# Altium schematic sheet mini_backplane.SchDoc
size A3
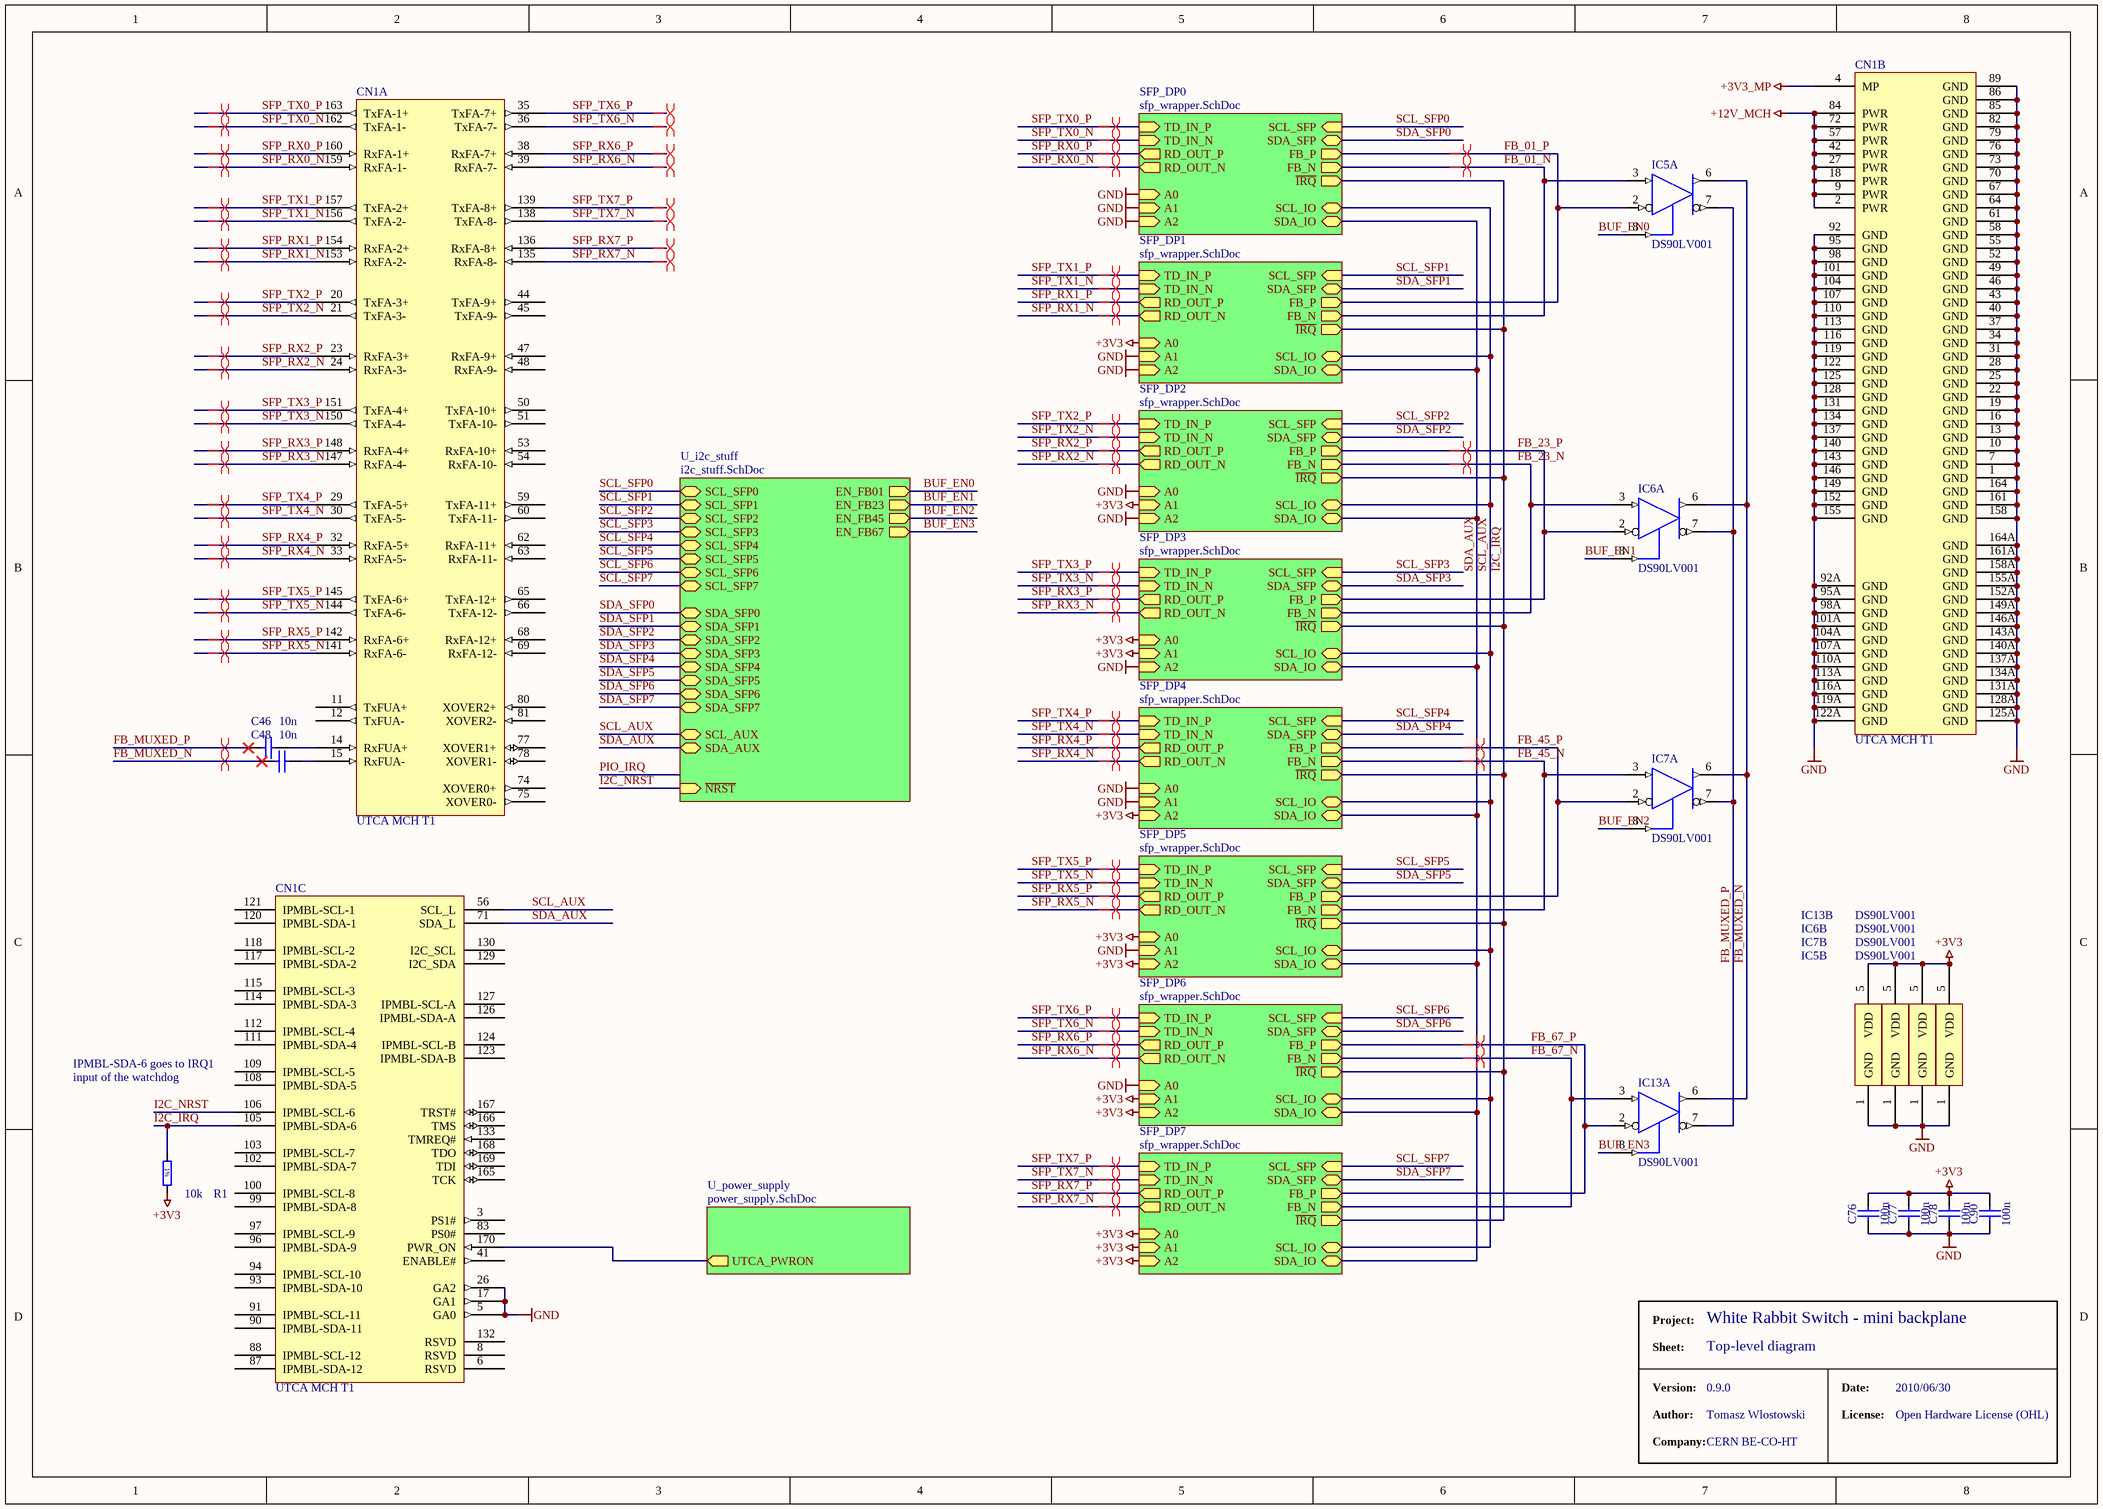
[diagram p0: mini_backplane.SchDoc]

## Parts
C46  10n  [CAPC1608X87N]
C48  10n  [CAPC1608X87N]
C76  100n  [CAPC1608X87N]
C77  100n  [CAPC1608X87N]
C78  100n  [CAPC1608X87N]
C90  100n  [CAPC1608X87N]
CN1  UTCA MCH T1  [CON_AMC_MOLEX_75800_00001_REVERSE]  (parts A,B,C of 3)
IC5  DS90LV001  [SOIC127P600-8AL]  (parts A,B of 2)
IC6  DS90LV001  [SOIC127P600-8AL]  (parts A,B of 2)
IC7  DS90LV001  [SOIC127P600-8AL]  (parts A,B of 2)
IC13  DS90LV001  [SOIC127P600-8AL]  (parts A,B of 2)
R1  10k  [RESC1608X55N]

## Sub-sheets
SFP_DP0 = sfp_wrapper.SchDoc: RD_OUT_N (out), RD_OUT_P (out), TD_IN_N (in), TD_IN_P (in), SDA_SFP (bidir), SCL_SFP (in), FB_P (out), FB_N (out), ~{IRQ} (out), A0 (in), A1 (in), A2 (in), SCL_IO (bidir), SDA_IO (bidir)
SFP_DP1 = sfp_wrapper.SchDoc: RD_OUT_N (out), RD_OUT_P (out), TD_IN_N (in), TD_IN_P (in), SDA_SFP (bidir), SCL_SFP (in), FB_P (out), FB_N (out), ~{IRQ} (out), A0 (in), A1 (in), A2 (in), SCL_IO (bidir), SDA_IO (bidir)
SFP_DP2 = sfp_wrapper.SchDoc: RD_OUT_N (out), RD_OUT_P (out), TD_IN_N (in), TD_IN_P (in), SDA_SFP (bidir), SCL_SFP (in), FB_P (out), FB_N (out), ~{IRQ} (out), A0 (in), A1 (in), A2 (in), SCL_IO (bidir), SDA_IO (bidir)
SFP_DP3 = sfp_wrapper.SchDoc: RD_OUT_N (out), RD_OUT_P (out), TD_IN_N (in), TD_IN_P (in), SDA_SFP (bidir), SCL_SFP (in), FB_P (out), FB_N (out), ~{IRQ} (out), A0 (in), A1 (in), A2 (in), SCL_IO (bidir), SDA_IO (bidir)
SFP_DP4 = sfp_wrapper.SchDoc: RD_OUT_N (out), RD_OUT_P (out), TD_IN_N (in), TD_IN_P (in), SDA_SFP (bidir), SCL_SFP (in), FB_P (out), FB_N (out), ~{IRQ} (out), A0 (in), A1 (in), A2 (in), SCL_IO (bidir), SDA_IO (bidir)
SFP_DP5 = sfp_wrapper.SchDoc: RD_OUT_N (out), RD_OUT_P (out), TD_IN_N (in), TD_IN_P (in), SDA_SFP (bidir), SCL_SFP (in), FB_P (out), FB_N (out), ~{IRQ} (out), A0 (in), A1 (in), A2 (in), SCL_IO (bidir), SDA_IO (bidir)
SFP_DP6 = sfp_wrapper.SchDoc: RD_OUT_N (out), RD_OUT_P (out), TD_IN_N (in), TD_IN_P (in), SDA_SFP (bidir), SCL_SFP (in), FB_P (out), FB_N (out), ~{IRQ} (out), A0 (in), A1 (in), A2 (in), SCL_IO (bidir), SDA_IO (bidir)
SFP_DP7 = sfp_wrapper.SchDoc: RD_OUT_N (out), RD_OUT_P (out), TD_IN_N (in), TD_IN_P (in), SDA_SFP (bidir), SCL_SFP (in), FB_P (out), FB_N (out), ~{IRQ} (out), A0 (in), A1 (in), A2 (in), SCL_IO (bidir), SDA_IO (bidir)
U_i2c_stuff = i2c_stuff.SchDoc: SCL_SFP0 (bidir), SCL_SFP1 (bidir), SCL_SFP2 (bidir), SCL_SFP3 (bidir), SCL_SFP4 (bidir), SCL_SFP5 (bidir), SCL_SFP6 (bidir), SCL_SFP7 (bidir), SDA_SFP0 (bidir), SDA_SFP1 (bidir), SDA_SFP2 (bidir), SDA_SFP3 (bidir), SDA_SFP4 (bidir), SDA_SFP5 (bidir), SDA_SFP6 (bidir), SDA_SFP7 (bidir), SCL_AUX (bidir), SDA_AUX (bidir), ~{NRST} (in), EN_FB01 (out), EN_FB23 (out), EN_FB45 (out), EN_FB67 (out)
U_power_supply = power_supply.SchDoc: UTCA_PWRON (out)

## Nets
+3V3: C76.2 C77.2 C78.2 C90.2 IC5.5(VDD) IC6.5(VDD) IC7.5(VDD) IC13.5(VDD) R1.2 ; sheet SFP_DP1/A0, sheet SFP_DP2/A1, sheet SFP_DP3/A0, sheet SFP_DP3/A1, sheet SFP_DP4/A2, sheet SFP_DP5/A0, sheet SFP_DP5/A2, sheet SFP_DP6/A1, sheet SFP_DP6/A2, sheet SFP_DP7/A0, sheet SFP_DP7/A1, sheet SFP_DP7/A2
+3V3_MP: CN1.4(MP)
+12V_MCH: CN1.2(PWR) CN1.9(PWR) CN1.18(PWR) CN1.27(PWR) CN1.42(PWR) CN1.57(PWR) CN1.72(PWR) CN1.84(PWR)
GND: C76.1 C77.1 C78.1 C90.1 CN1.1(GND) CN1.5(GA0) CN1.7(GND) CN1.10(GND) CN1.13(GND) CN1.16(GND) CN1.17(GA1) CN1.19(GND) CN1.22(GND) CN1.25(GND) CN1.26(GA2) CN1.28(GND) CN1.31(GND) CN1.34(GND) CN1.37(GND) CN1.40(GND) CN1.43(GND) CN1.46(GND) CN1.49(GND) CN1.52(GND) CN1.55(GND) CN1.58(GND) CN1.61(GND) CN1.64(GND) CN1.67(GND) CN1.70(GND) CN1.73(GND) CN1.76(GND) CN1.79(GND) CN1.82(GND) CN1.85(GND) CN1.86(GND) CN1.89(GND) CN1.92(GND) CN1.92A(GND) CN1.95(GND) CN1.95A(GND) CN1.98(GND) CN1.98A(GND) CN1.101(GND) CN1.101A(GND) CN1.104(GND) CN1.104A(GND) CN1.107(GND) CN1.107A(GND) CN1.110(GND) CN1.110A(GND) CN1.113(GND) CN1.113A(GND) CN1.116(GND) CN1.116A(GND) CN1.119(GND) CN1.119A(GND) CN1.122(GND) CN1.122A(GND) CN1.125(GND) CN1.125A(GND) CN1.128(GND) CN1.128A(GND) CN1.131(GND) CN1.131A(GND) CN1.134(GND) CN1.134A(GND) CN1.137(GND) CN1.137A(GND) CN1.140(GND) CN1.140A(GND) CN1.143(GND) CN1.143A(GND) CN1.146(GND) CN1.146A(GND) CN1.149(GND) CN1.149A(GND) CN1.152(GND) CN1.152A(GND) CN1.155(GND) CN1.155A(GND) CN1.158(GND) CN1.158A(GND) CN1.161(GND) CN1.161A(GND) CN1.164(GND) CN1.164A(GND) IC5.1(GND) IC6.1(GND) IC7.1(GND) IC13.1(GND) ; sheet SFP_DP0/A0, sheet SFP_DP0/A1, sheet SFP_DP0/A2, sheet SFP_DP1/A1, sheet SFP_DP1/A2, sheet SFP_DP2/A0, sheet SFP_DP2/A2, sheet SFP_DP3/A2, sheet SFP_DP4/A0, sheet SFP_DP4/A1, sheet SFP_DP5/A1, sheet SFP_DP6/A0
BUF_EN0: IC5.8(EN) ; sheet U_i2c_stuff/EN_FB01
BUF_EN1: IC6.8(EN) ; sheet U_i2c_stuff/EN_FB23
BUF_EN2: IC7.8(EN) ; sheet U_i2c_stuff/EN_FB45
BUF_EN3: IC13.8(EN) ; sheet U_i2c_stuff/EN_FB67
FB_01_N: IC5.3(IN+) ; sheet SFP_DP0/FB_N, sheet SFP_DP1/FB_N
FB_01_P: IC5.2(IN-) ; sheet SFP_DP0/FB_P, sheet SFP_DP1/FB_P
FB_23_N: IC6.3(IN+) ; sheet SFP_DP2/FB_N, sheet SFP_DP3/FB_N
FB_23_P: IC6.2(IN-) ; sheet SFP_DP2/FB_P, sheet SFP_DP3/FB_P
FB_45_N: IC7.3(IN+) ; sheet SFP_DP4/FB_N, sheet SFP_DP5/FB_N
FB_45_P: IC7.2(IN-) ; sheet SFP_DP4/FB_P, sheet SFP_DP5/FB_P
FB_67_N: IC13.3(IN+) ; sheet SFP_DP6/FB_N, sheet SFP_DP7/FB_N
FB_67_P: IC13.2(IN-) ; sheet SFP_DP6/FB_P, sheet SFP_DP7/FB_P
FB_MUXED_N: C48.1 IC5.6(OUT+) IC6.6(OUT+) IC7.6(OUT+) IC13.6(OUT+)
FB_MUXED_P: C46.1 IC5.7(OUT-) IC6.7(OUT-) IC7.7(OUT-) IC13.7(OUT-)
I2C_IRQ: CN1.105(IPMBL-SDA-6) R1.1 ; sheet SFP_DP0/~{IRQ}, sheet SFP_DP1/~{IRQ}, sheet SFP_DP2/~{IRQ}, sheet SFP_DP3/~{IRQ}, sheet SFP_DP4/~{IRQ}, sheet SFP_DP5/~{IRQ}, sheet SFP_DP6/~{IRQ}, sheet SFP_DP7/~{IRQ}
I2C_NRST: CN1.106(IPMBL-SCL-6) ; sheet U_i2c_stuff/~{NRST}
SCL_AUX: CN1.56(SCL_L) ; sheet SFP_DP0/SCL_IO, sheet SFP_DP1/SCL_IO, sheet SFP_DP2/SCL_IO, sheet SFP_DP3/SCL_IO, sheet SFP_DP4/SCL_IO, sheet SFP_DP5/SCL_IO, sheet SFP_DP6/SCL_IO, sheet SFP_DP7/SCL_IO, sheet U_i2c_stuff/SCL_AUX
SCL_SFP0: sheet SFP_DP0/SCL_SFP, sheet U_i2c_stuff/SCL_SFP0
SCL_SFP1: sheet SFP_DP1/SCL_SFP, sheet U_i2c_stuff/SCL_SFP1
SCL_SFP2: sheet SFP_DP2/SCL_SFP, sheet U_i2c_stuff/SCL_SFP2
SCL_SFP3: sheet SFP_DP3/SCL_SFP, sheet U_i2c_stuff/SCL_SFP3
SCL_SFP4: sheet SFP_DP4/SCL_SFP, sheet U_i2c_stuff/SCL_SFP4
SCL_SFP5: sheet SFP_DP5/SCL_SFP, sheet U_i2c_stuff/SCL_SFP5
SCL_SFP6: sheet SFP_DP6/SCL_SFP, sheet U_i2c_stuff/SCL_SFP6
SCL_SFP7: sheet SFP_DP7/SCL_SFP, sheet U_i2c_stuff/SCL_SFP7
SDA_AUX: CN1.71(SDA_L) ; sheet SFP_DP0/SDA_IO, sheet SFP_DP1/SDA_IO, sheet SFP_DP2/SDA_IO, sheet SFP_DP3/SDA_IO, sheet SFP_DP4/SDA_IO, sheet SFP_DP5/SDA_IO, sheet SFP_DP6/SDA_IO, sheet SFP_DP7/SDA_IO, sheet U_i2c_stuff/SDA_AUX
SDA_SFP0: sheet SFP_DP0/SDA_SFP, sheet U_i2c_stuff/SDA_SFP0
SDA_SFP1: sheet SFP_DP1/SDA_SFP, sheet U_i2c_stuff/SDA_SFP1
SDA_SFP2: sheet SFP_DP2/SDA_SFP, sheet U_i2c_stuff/SDA_SFP2
SDA_SFP3: sheet SFP_DP3/SDA_SFP, sheet U_i2c_stuff/SDA_SFP3
SDA_SFP4: sheet SFP_DP4/SDA_SFP, sheet U_i2c_stuff/SDA_SFP4
SDA_SFP5: sheet SFP_DP5/SDA_SFP, sheet U_i2c_stuff/SDA_SFP5
SDA_SFP6: sheet SFP_DP6/SDA_SFP, sheet U_i2c_stuff/SDA_SFP6
SDA_SFP7: sheet SFP_DP7/SDA_SFP, sheet U_i2c_stuff/SDA_SFP7
SFP_RX0_N: CN1.159(RxFA-1-) ; sheet SFP_DP0/RD_OUT_N
SFP_RX0_P: CN1.160(RxFA-1+) ; sheet SFP_DP0/RD_OUT_P
SFP_RX1_N: CN1.153(RxFA-2-) ; sheet SFP_DP1/RD_OUT_N
SFP_RX1_P: CN1.154(RxFA-2+) ; sheet SFP_DP1/RD_OUT_P
SFP_RX2_N: CN1.24(RxFA-3-) ; sheet SFP_DP2/RD_OUT_N
SFP_RX2_P: CN1.23(RxFA-3+) ; sheet SFP_DP2/RD_OUT_P
SFP_RX3_N: CN1.147(RxFA-4-) ; sheet SFP_DP3/RD_OUT_N
SFP_RX3_P: CN1.148(RxFA-4+) ; sheet SFP_DP3/RD_OUT_P
SFP_RX4_N: CN1.33(RxFA-5-) ; sheet SFP_DP4/RD_OUT_N
SFP_RX4_P: CN1.32(RxFA-5+) ; sheet SFP_DP4/RD_OUT_P
SFP_RX5_N: CN1.141(RxFA-6-) ; sheet SFP_DP5/RD_OUT_N
SFP_RX5_P: CN1.142(RxFA-6+) ; sheet SFP_DP5/RD_OUT_P
SFP_RX6_N: CN1.39(RxFA-7-) ; sheet SFP_DP6/RD_OUT_N
SFP_RX6_P: CN1.38(RxFA-7+) ; sheet SFP_DP6/RD_OUT_P
SFP_RX7_N: CN1.135(RxFA-8-) ; sheet SFP_DP7/RD_OUT_N
SFP_RX7_P: CN1.136(RxFA-8+) ; sheet SFP_DP7/RD_OUT_P
SFP_TX0_N: CN1.162(TxFA-1-) ; sheet SFP_DP0/TD_IN_N
SFP_TX0_P: CN1.163(TxFA-1+) ; sheet SFP_DP0/TD_IN_P
SFP_TX1_N: CN1.156(TxFA-2-) ; sheet SFP_DP1/TD_IN_N
SFP_TX1_P: CN1.157(TxFA-2+) ; sheet SFP_DP1/TD_IN_P
SFP_TX2_N: CN1.21(TxFA-3-) ; sheet SFP_DP2/TD_IN_N
SFP_TX2_P: CN1.20(TxFA-3+) ; sheet SFP_DP2/TD_IN_P
SFP_TX3_N: CN1.150(TxFA-4-) ; sheet SFP_DP3/TD_IN_N
SFP_TX3_P: CN1.151(TxFA-4+) ; sheet SFP_DP3/TD_IN_P
SFP_TX4_N: CN1.30(TxFA-5-) ; sheet SFP_DP4/TD_IN_N
SFP_TX4_P: CN1.29(TxFA-5+) ; sheet SFP_DP4/TD_IN_P
SFP_TX5_N: CN1.144(TxFA-6-) ; sheet SFP_DP5/TD_IN_N
SFP_TX5_P: CN1.145(TxFA-6+) ; sheet SFP_DP5/TD_IN_P
SFP_TX6_N: CN1.36(TxFA-7-) ; sheet SFP_DP6/TD_IN_N
SFP_TX6_P: CN1.35(TxFA-7+) ; sheet SFP_DP6/TD_IN_P
SFP_TX7_N: CN1.138(TxFA-8-) ; sheet SFP_DP7/TD_IN_N
SFP_TX7_P: CN1.139(TxFA-8+) ; sheet SFP_DP7/TD_IN_P
NetC46_2: C46.2 CN1.14(RxFUA+)
NetC48_2: C48.2 CN1.15(RxFUA-)
NetCN1_170: CN1.170(PWR_ON) ; sheet U_power_supply/UTCA_PWRON

Not connected (* = marked no-connect by the designer): CN1 3(PS1#) 6(RSVD) 8(RSVD) 11(TxFUA+) 12(TxFUA-) 41(ENABLE#) 44(TxFA-9+) 45(TxFA-9-) 47(RxFA-9+) 48(RxFA-9-) 50(TxFA-10+) 51(TxFA-10-) 53(RxFA-10+) 54(RxFA-10-) 59(TxFA-11+) 60(TxFA-11-) 62(RxFA-11+) 63(RxFA-11-) 65(TxFA-12+) 66(TxFA-12-) 68(RxFA-12+) 69(RxFA-12-) 74(XOVER0+) 75(XOVER0-) 77(XOVER1+) 78(XOVER1-) 80(XOVER2+) 81(XOVER2-) 83(PS0#) 87(IPMBL-SDA-12) 88(IPMBL-SCL-12) 90(IPMBL-SDA-11) 91(IPMBL-SCL-11) 93(IPMBL-SDA-10) 94(IPMBL-SCL-10) 96(IPMBL-SDA-9) 97(IPMBL-SCL-9) 99(IPMBL-SDA-8) 100(IPMBL-SCL-8) 102(IPMBL-SDA-7) 103(IPMBL-SCL-7) 108(IPMBL-SDA-5) 109(IPMBL-SCL-5) 111(IPMBL-SDA-4) 112(IPMBL-SCL-4) 114(IPMBL-SDA-3) 115(IPMBL-SCL-3) 117(IPMBL-SDA-2) 118(IPMBL-SCL-2) 120(IPMBL-SDA-1) 121(IPMBL-SCL-1) 123(IPMBL-SDA-B) 124(IPMBL-SCL-B) 126(IPMBL-SDA-A) 127(IPMBL-SCL-A) 129(I2C_SDA) 130(I2C_SCL) 132(RSVD) 133(TMREQ#) 165(TCK) 166(TMS) 167(TRST#) 168(TDO) 169(TDI)

## Layout directives
differential pair: FB_01_N, FB_01_P, FB_23_N, FB_23_P, FB_45_N, FB_45_P, FB_67_N, FB_67_P, FB_MUXED_N, FB_MUXED_P, SFP_RX0_N, SFP_RX0_P, SFP_RX1_N, SFP_RX1_P, SFP_RX2_N, SFP_RX2_P, SFP_RX3_N, SFP_RX3_P, SFP_RX4_N, SFP_RX4_P, SFP_RX5_N, SFP_RX5_P, SFP_RX6_N, SFP_RX6_P, SFP_RX7_N, SFP_RX7_P, SFP_TX0_N, SFP_TX0_P, SFP_TX1_N, SFP_TX1_P, SFP_TX2_N, SFP_TX2_P, SFP_TX3_N, SFP_TX3_P, SFP_TX4_N, SFP_TX4_P, SFP_TX5_N, SFP_TX5_P, SFP_TX6_N, SFP_TX6_P, SFP_TX7_N, SFP_TX7_P

## Notes on the sheet
- IPMBL-SDA-6 goes to IRQ1
- input of the watchdog
- Project:
- White Rabbit Switch - mini backplane
- Sheet:
- Version:
- Top-level diagram
- 0.9.0
- Date:
- 2010/06/30
- Author:
- Company:
- Tomasz Wlostowski
- CERN BE-CO-HT
- License:
- Open Hardware License (OHL)
- (in symbol R0603_10K_1%_0.1W_100PPM) 1%

## Library data of the parts
C46 C48 = CC0603_10NF_50V_10%_X7R: Non-polarised capacitor; Part Description: SMD Multilayer Chip Ceramic Capacitor; Manufacturer: GENERIC; Manufacturer1 Part Number: 223858615636; Value: 10nF; Voltage: 50V; TC: X7R; Tolerance: ±10%; Table: Capacitors SMD; Part Number: CC0603_10NF_50V_10%_X7R; Component Kind: Standard; Component Type: Standard; Pin Count: 2; Status: Preferred; Manufacturer Part Number: CC0603_10NF_50V_10%_X7R; Case: 0603; Mounted: Yes; Socket: No; SMD: Yes; Manufacturer1 Example: PHYCOMP; Manufacturer1 ComponentHeight: 0.87mm; HelpURL: \\cern.ch\dfs\Applications\Altium\Datasheets\CC0603_X7R_PHYCOMP.pdf; Author: CERN DEM JLC; CreateDate: 12/3/2007; LatestRevisionDate: 12/3/2007
C76-C78 C90 = CC0603_100NF_50V_10%_X7R: Non-polarised capacitor; Part Description: SMD Multilayer Chip Ceramic Capacitor; Manufacturer: GENERIC; Manufacturer1 Part Number: 223858615649; Manufacturer1 Datasheet: \\cern.ch\dfs\Applications\Altium\Datasheets\CC0603_X7R_PHYCOMP.pdf; Value: 100nF; Voltage: 50V; TC: X7R; Tolerance: ±10%; Table: Capacitors SMD; Part Number: CC0603_100NF_50V_10%_X7R; Component Kind: Standard; Component Type: Standard; Designator: Capacitor - non polarized; Library Reference: Capacitor - non polarized; Pin Count: 2; Status: Preferred; Manufacturer Part Number: CC0603_100NF_50V_10%_X7R; Case: 0603; Mounted: Yes; Socket: No; SMD: Yes; Manufacturer1 Example: PHYCOMP; Manufacturer1 ComponentHeight: 0.87mm; HelpURL: \\cern.ch\dfs\Applications\Altium\Datasheets\CC0603_X7R_PHYCOMP.pdf; Author: CERN DEM JLC; CreateDate: 12/3/2007; LatestRevisionDate: 12/3/2007
CN1 = UTCA_MCH_SOCKET: microTCA MTCA.0  MCH socket (AMC0.0 B+ connector with reversed pins); Value: MCH tongue 1; Value: MOLEX 75800-00001; RefId: 1353569; Supplier: Farnell
IC5-IC7 IC13 = DS90LV001: LVDS buffer with enable
R1 = R0603_10K_1%_0.1W_100PPM: Resistor - 1%; Part Description: General Purpose Thick Film Chip Resistor; Manufacturer: GENERIC; Manufacturer1 Part Number: NRC06F1002TRF; Power: 0.1W; TC: ±100ppm/°C; Table: Resistors SMD; Part Number: R0603_10K_1%_0.1W_100PPM; Component Kind: Standard; Component Type: Standard; Pin Count: 2; Value: 10k; Status: Preferred; Tolerance: ±1%; Manufacturer Part Number: R0603_10K_1%_0.1W_100PPM; Case: 0603; Mounted: Yes; Socket: No; SMD: Yes; Manufacturer1 Example: NIC COMPONENT; Manufacturer1 ComponentHeight: 0.55mm; HelpURL: \\cern.ch\dfs\Applications\Altium\Datasheets\R0603_NIC_NRC.pdf; Author: CERN DEM JLC; CreateDate: 12/3/2007; LatestRevisionDate: 3/13/2008